# EasyEDA Pro project BN-CAN.epro

# Board PCB5
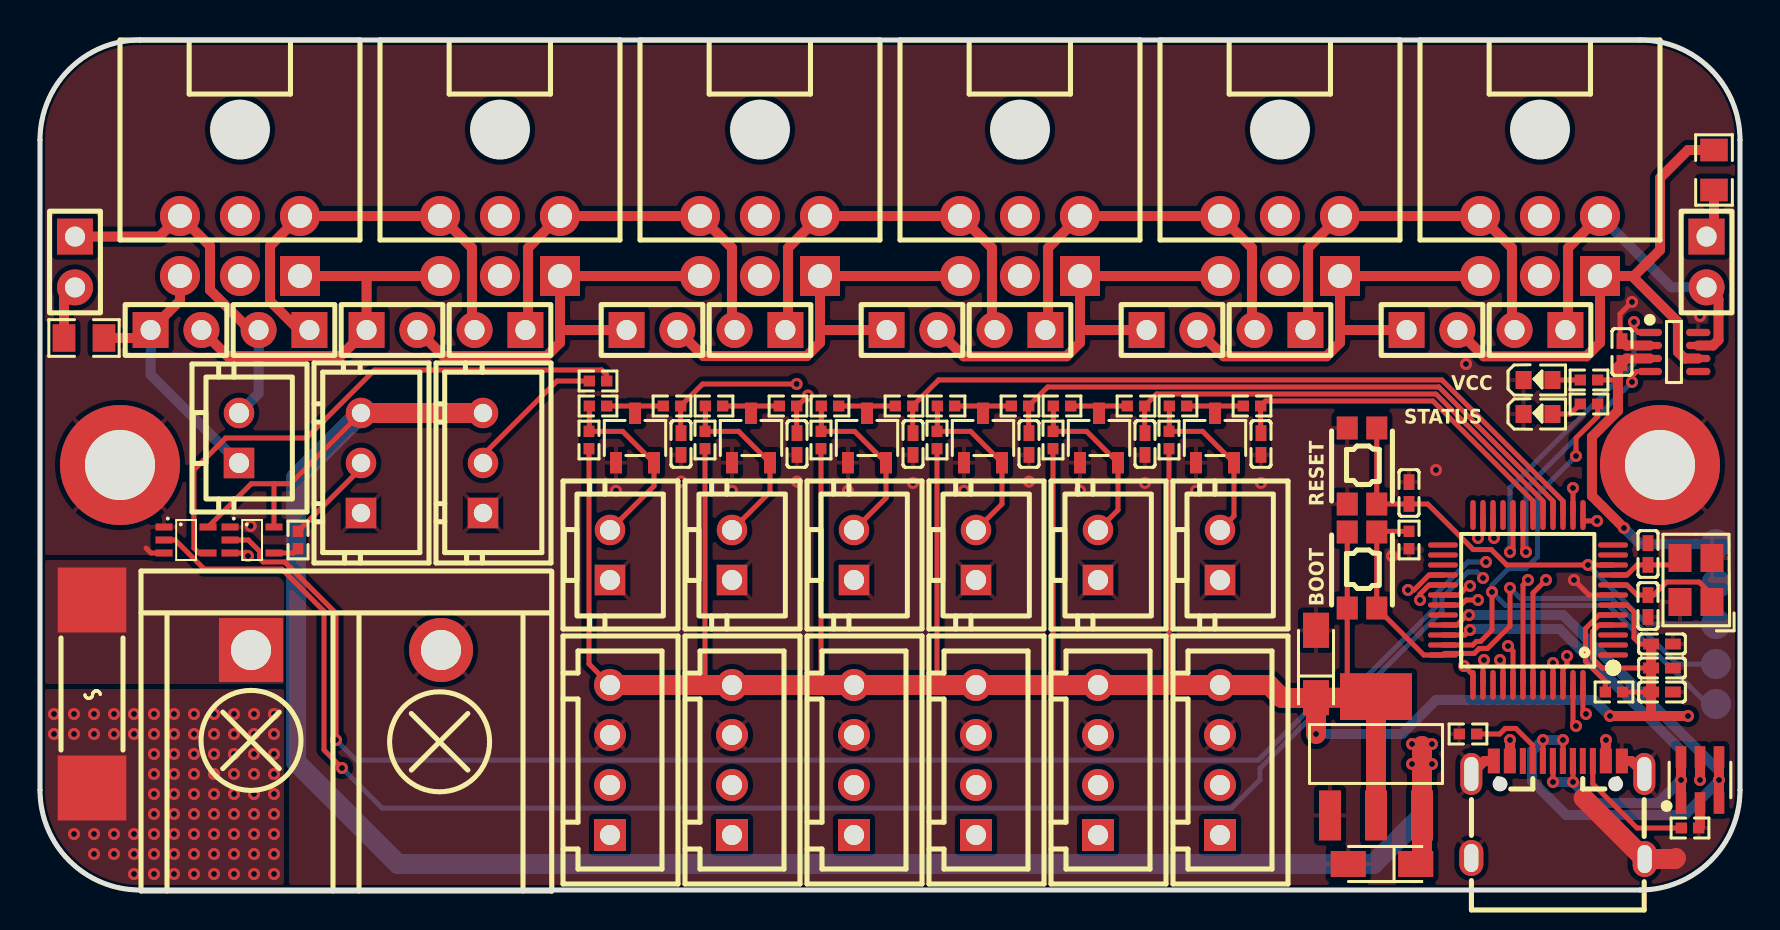
[diagram p0: board, top side]
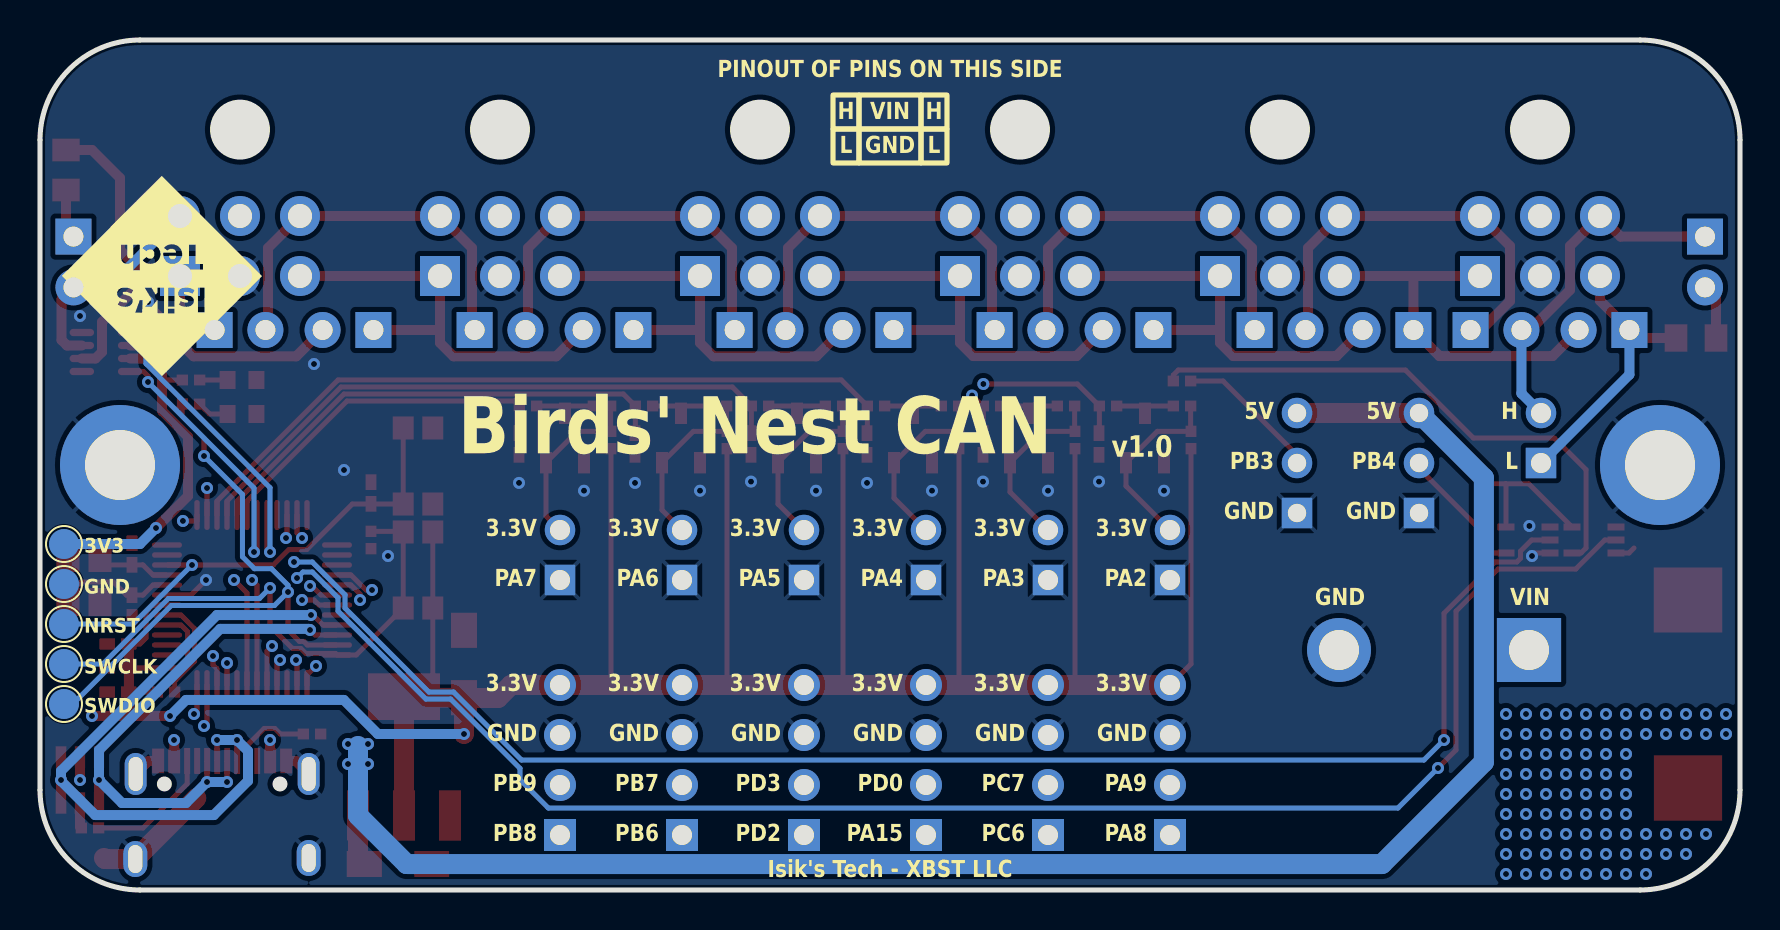
[diagram p1: board, bottom side, seen from below]

Outline 85 x 42.5 mm; copper layers: Top Layer, Inner1, Inner2, Bottom Layer. Coordinates in mm from the lower left corner of the outline.
Outline path: 0,37.5 0,5 arc(1.46,1.46) 5,0 80,0 arc(83.54,1.46) 85,5 85,37.5 arc(83.54,41.04) 80,42.5 5,42.5 arc(1.46,41.04) 0,37.5
Stack: Top Layer 0.035mm 外层铜厚1oz / Dielectric1 0.2104mm 7628 RC49% 8.6mil / Inner1 0.0152mm 内层铜厚 / Dielectric2 1.065mm 1.1mm H/HOZ 含铜 / Inner2 0.0152mm 内层铜厚 / Dielectric3 0.2104mm 7628 RC49% 8.6mil / Bottom Layer 0.035mm 外层铜厚1oz

## Design rules (mm)
template: Custom Config
spacing copperThickness1oz (default): track to track 0.102, other pairs 0.152 to 0.3
spacing copperThickness2oz: track to track 0.203, other pairs 0.152 to 0.3
track width copperThickness1oz (default): min 0.127, default 0.254, max 2.54
track width copperThickness2oz: min 0.203, default 0.254, max 2.54
differential pair differentialPair (default): width min 0.127, default 0.254, max 2.54; gap min 0.152, default 0.152
via viaSize (default): diameter min 0.5, default 0.61, max 10; hole min 0.3, default 0.305, max 6.3
pour e106 uses copperRegion1
pour e108 uses copperRegion1

## Placement (name value [footprint] x y rotation side)
3V3  NO  [TP]  83.8 17.3 180 bottom
BOOT  EVPAA202K  [KEY-SMD_4P-L3.5-W2.9-P1.48-LS4.3-TL]  66.1 16 90 top
C1  10uF  [CAP-SMD_L3.2-W1.6-RD-C7171]  67.1 1.3 180 top
C2  10uF  [CAP-SMD_L3.2-W1.6-RD-C7171]  63.8 11.3 90 top
C3  100nF  [C0402]  81.1 11.1 180 top
C4  100nF  [C0402]  32.05 22.3 90 top
C5  30pF  [C0402]  80.4 14.2 90 top
C6  30pF  [C0402]  80.4 16.8 270 top
C7  100nF  [C0402]  81.1 12.3 180 top
C8  100nF  [C0402]  81.1 9.9 180 top
C9  100nF  [C0402]  37.85 22.3 90 top
C10  100nF  [C0402]  68.45 19.85 90 top
C11  100nF  [C0402]  43.65 22.3 90 top
C12  100nF  [C0402]  79.1 26.9 270 top
C13  100nF  [C0402]  49.45 22.3 90 top
C14  100nF  [C0402]  55.25 22.3 90 top
C15  100nF  [C0402]  61.05 22.3 90 top
CAN1  HC-MX3.0-2*3AW  [CONN-TH_6P-P3.00_HC-MX3.0-2X3AW]  75 32.2 180 top
CAN2  HC-MX3.0-2*3AW  [CONN-TH_6P-P3.00_HC-MX3.0-2X3AW]  62 32.2 180 top
CAN3  HC-MX3.0-2*3AW  [CONN-TH_6P-P3.00_HC-MX3.0-2X3AW]  49 32.2 180 top
CAN4  HC-MX3.0-2*3AW  [CONN-TH_6P-P3.00_HC-MX3.0-2X3AW]  36 32.2 180 top
CAN5  HC-MX3.0-2*3AW  [CONN-TH_6P-P3.00_HC-MX3.0-2X3AW]  23 32.2 180 top
CAN6  HC-MX3.0-2*3AW  [CONN-TH_6P-P3.00_HC-MX3.0-2X3AW]  10 32.2 180 top
CAN_EXP  B2B-XH-A-BK(LF)(SN)  [CONN-TH_2P-P2.50_JST_B2B-XH-A-M]  9.95 22.6 270 top
CAN_TERM1  B-2100S02P-A110  [HDR-TH_2P-P2.54-V-M-1]  83.33 31.4 270 top
CAN_TERM2  B-2100S02P-A110  [HDR-TH_2P-P2.54-V-M-1]  1.75 31.4 270 top
D1  USBLC6-2SC6  [SOT-23-6_L2.9-W1.6-P0.95-LS2.8-BL]  83 5.5 0 top
D2  BAV99,215  [SOT-23-3_L2.9-W1.6-P1.90-LS2.8-BR]  29.75 22.6 270 top
D3  BAV99,215  [SOT-23-3_L2.9-W1.6-P1.90-LS2.8-BR]  35.55 22.6 270 top
D4  BAV99,215  [SOT-23-3_L2.9-W1.6-P1.90-LS2.8-BR]  41.35 22.6 270 top
D5  BAV99,215  [SOT-23-3_L2.9-W1.6-P1.90-LS2.8-BR]  47.15 22.6 270 top
D6  BAV99,215  [SOT-23-3_L2.9-W1.6-P1.90-LS2.8-BR]  52.95 22.6 270 top
D7  BAV99,215  [SOT-23-3_L2.9-W1.6-P1.90-LS2.8-BR]  58.75 22.6 270 top
F1  0456030.ER  [FUSE-SMD_L10.1-W3.1]  2.6 9.8 90 top
FS1  B4B-XH-A-BK(LF)(SN)  [CONN-TH_B4B-XH-A-BK-LF-SN]  59 6.5 90 top
FS2  B4B-XH-A-BK(LF)(SN)  [CONN-TH_B4B-XH-A-BK-LF-SN]  52.9 6.5 90 top
FS3  B4B-XH-A-BK(LF)(SN)  [CONN-TH_B4B-XH-A-BK-LF-SN]  46.8 6.5 90 top
FS4  B4B-XH-A-BK(LF)(SN)  [CONN-TH_B4B-XH-A-BK-LF-SN]  40.7 6.5 90 top
FS5  B4B-XH-A-BK(LF)(SN)  [CONN-TH_B4B-XH-A-BK-LF-SN]  34.6 6.5 90 top
FS6  B4B-XH-A-BK(LF)(SN)  [CONN-TH_B4B-XH-A-BK-LF-SN]  28.5 6.5 90 top
GND  NO  [TP]  83.8 15.3 180 bottom
H_JUMPER1  B-2100S02P-A110  [HDR-TH_2P-P2.54-V-M-1]  75 28 180 top
H_JUMPER2  B-2100S02P-A110  [HDR-TH_2P-P2.54-V-M-1]  62 28 180 top
H_JUMPER3  B-2100S02P-A110  [HDR-TH_2P-P2.54-V-M-1]  49 28 180 top
H_JUMPER4  B-2100S02P-A110  [HDR-TH_2P-P2.54-V-M-1]  36 28 180 top
H_JUMPER5  B-2100S02P-A110  [HDR-TH_2P-P2.54-V-M-1]  23 28 180 top
H_JUMPER6  B-2100S02P-A110  [HDR-TH_2P-P2.54-V-M-1]  12.2 28 180 top
L_JUMPER1  B-2100S02P-A110  [HDR-TH_2P-P2.54-V-M-1]  69.6 28 0 top
L_JUMPER2  B-2100S02P-A110  [HDR-TH_2P-P2.54-V-M-1]  56.6 28 0 top
L_JUMPER3  B-2100S02P-A110  [HDR-TH_2P-P2.54-V-M-1]  43.6 28 0 top
L_JUMPER4  B-2100S02P-A110  [HDR-TH_2P-P2.54-V-M-1]  30.6 28 0 top
L_JUMPER5  B-2100S02P-A110  [HDR-TH_2P-P2.54-V-M-1]  17.6 28 0 top
L_JUMPER6  B-2100S02P-A110  [HDR-TH_2P-P2.54-V-M-1]  6.8 28 0 top
NOREF  -  [Pad_e236]  81 21.25 0 top
NOREF#2  -  [Pad_e234]  4 21.25 0 top
NRST  NO  [TP]  83.8 13.3 180 bottom
R1  5.1kΩ  [R0402]  82.5 3.1 180 top
R2  470Ω  [R0402]  27.9 25.45 180 top
R3  470Ω  [R0402]  12.9 17.5 90 top
R4  5.1kΩ  [R0402]  71.4 7.8 180 top
R6  4.7kΩ  [R0402]  27.45 22.5 90 top
R7  2.37kΩ  [R0402]  27.9 24.2 0 top
R8  2.37kΩ  [R0402]  31.6 24.2 0 top
R9  1.5kΩ  [R0402]  77.45 25.5 180 top
R10  10Ω  [R0402]  78.7 9.9 0 top
R11  1.5kΩ  [R0402]  77.45 24.3 180 top
R12  4.7kΩ  [R0402]  33.25 22.5 90 top
R13  10kΩ  [R0402]  68.45 17.5 270 top
R14  2.37kΩ  [R0402]  33.7 24.2 0 top
R15  2.37kΩ  [R0402]  37.4 24.2 0 top
R16  4.7kΩ  [R0402]  39.05 22.5 90 top
R17  2.37kΩ  [R0402]  39.5 24.2 0 top
R18  2.37kΩ  [R0402]  43.2 24.2 0 top
R19  120Ω  [R0805]  83.7 36 90 top
R20  4.7kΩ  [R0402]  44.85 22.5 90 top
R21  2.37kΩ  [R0402]  45.3 24.2 0 top
R22  2.37kΩ  [R0402]  49 24.2 0 top
R23  4.7kΩ  [R0402]  50.65 22.5 90 top
R24  2.37kΩ  [R0402]  51.1 24.2 0 top
R25  2.37kΩ  [R0402]  54.8 24.2 0 top
R26  4.7kΩ  [R0402]  56.45 22.5 90 top
R27  2.37kΩ  [R0402]  56.9 24.2 0 top
R28  2.37kΩ  [R0402]  60.6 24.2 0 top
R29  120Ω  [R0805]  2.2 27.6 180 top
RESET  EVPAA202K  [KEY-SMD_4P-L3.5-W2.9-P1.48-LS4.3-TL]  66.1 21.2 90 top
RGB1  B3B-XH-A-BK(LF)(SN)  [conn-th_3p-p2.50_b3b-xh-a-bk-lf-sn]  22.15 21.35 270 top
RGB2  B3B-XH-A-BK(LF)(SN)  [conn-th_3p-p2.50_b3b-xh-a-bk-lf-sn]  16.05 21.35 270 top
STATUS  19-217/BHC-ZL1M2RY/3T  [LED0603-FD_BLUE]  74.9 23.8 0 top
SWCLK  NO  [TP]  83.8 11.3 180 bottom
SWDIO  NO  [TP]  83.8 9.3 180 bottom
TERM  HB9500M-9.5-2P  [CONN-TH_HB9500M-9.5-2P]  15.3 12 0 top
TH1  B2B-XH-A-BK(LF)(SN)  [CONN-TH_2P-P2.50_JST_B2B-XH-A-M]  28.5 16.75 270 top
TH2  B2B-XH-A-BK(LF)(SN)  [CONN-TH_2P-P2.50_JST_B2B-XH-A-M]  34.6 16.75 270 top
TH3  B2B-XH-A-BK(LF)(SN)  [CONN-TH_2P-P2.50_JST_B2B-XH-A-M]  40.7 16.75 270 top
TH4  B2B-XH-A-BK(LF)(SN)  [CONN-TH_2P-P2.50_JST_B2B-XH-A-M]  46.8 16.75 270 top
TH5  B2B-XH-A-BK(LF)(SN)  [CONN-TH_2P-P2.50_JST_B2B-XH-A-M]  52.9 16.75 270 top
TH6  B2B-XH-A-BK(LF)(SN)  [CONN-TH_2P-P2.50_JST_B2B-XH-A-M]  59 16.75 270 top
U1  SN74AHCT1G125DCKR  [SC-70-5_L2.0-W1.3-P0.65-LS2.1-BL]  7.3 17.5 270 top
U2  SN74AHCT1G125DCKR  [SC-70-5_L2.0-W1.3-P0.65-LS2.1-BL]  10.6 17.5 270 top
U4  AMS1117-3.3  [SOT-223-3_L6.5-W3.4-P2.30-LS7.0-BR]  66.8 6.7 270 top
U5  MAX3051EKA+T  [SOT-23-8_L3.0-W1.7-P0.65-LS2.8-TL]  81.7 26.9 0 top
U6  STM32G0B1CBT6  [LQFP-48_L7.0-W7.0-P0.50-LS9.0-BL]  74.4 14.5 90 top
USBC  918-418K2023S40001  [usb-c-smd_type-c-usb-17]  75.9 4 0 top
VCC  19-217/BHC-ZL1M2RY/3T  [LED0603-FD_BLUE]  74.9 25.5 0 top
X1  8MHz  [CRYSTAL-SMD_4P-L3.2-W2.5-BL-2]  82.8 15.5 90 top

## Footprints (pads in the part's own frame, mm; a bottom-side part is the same pattern mirrored in y, then rotated)
C0402
  rect 0.79x0.54 smd: 1(-0.545,0) 2(0.545,0)
CAP-SMD_L3.2-W1.6-RD-C7171
  rect 1.758x1.296 smd: 1(-1.687,0) 2(1.687,0)
CONN-TH_2P-P2.50_JST_B2B-XH-A-M
  rect 1.524x1.524 hole 1: 1(1.25,0)
  round 1.524 hole 1: 2(-1.25,0)
conn-th_3p-p2.50_b3b-xh-a-bk-lf-sn
  round 1.524 hole 0.914: 1(-2.5,0) 2(0,0)
  rect 1.524x1.524 hole 0.914: 3(2.5,0)
CONN-TH_6P-P3.00_HC-MX3.0-2X3AW
  rect 2x2 hole 1.2: 1(-3,1.5)
  round 2 hole 1.2: 2(-3,-1.5) 3(0,1.5) 4(0,-1.5) 5(3,1.5) 6(3,-1.5)
CONN-TH_B4B-XH-A-BK-LF-SN
  rect 1.6x1.6 hole 1: 1(-3.75,0)
  round 1.6 hole 1: 2(-1.25,0) 3(1.25,0) 4(3.75,0)
CONN-TH_HB9500M-9.5-2P
  rect 3.21x3.2 hole 2: 1(-4.75,0)
  round 3.2 hole 2: 2(4.75,0)
CRYSTAL-SMD_4P-L3.2-W2.5-BL-2
  rect 1.4x1.15 smd: 1(-1.1,-0.8) 2(1.1,-0.8) 3(1.1,0.8) 4(-1.1,0.8)
FUSE-SMD_L10.1-W3.1
  rect 3.25x3.43 smd: 1(-4.7,0) 2(4.7,0)
HDR-TH_2P-P2.54-V-M-1
  rect 1.8x1.8 hole 1: 1(-1.27,0)
  round 1.8 hole 1: 2(1.27,0)
KEY-SMD_4P-L3.5-W2.9-P1.48-LS4.3-TL
  rect 1.15x1.05 smd: 1(-1.902,0.74) 1'(1.899,0.74) 2(-1.902,-0.74) 2'(1.902,-0.74)
LED0603-FD_BLUE
  rect 0.8x0.9 smd: 1(-0.72,0) 2(0.72,0)
LQFP-48_L7.0-W7.0-P0.50-LS9.0-BL
  oval 0.27x1.5 smd: 1(-2.75,-4.25) 2(-2.25,-4.25) 3(-1.75,-4.25) 4(-1.25,-4.25) 5(-0.75,-4.25) 6(-0.25,-4.25) 7(0.25,-4.25) 8(0.75,-4.25) 9(1.25,-4.25) 10(1.75,-4.25) 11(2.25,-4.25) 12(2.75,-4.25) 25(2.75,4.25) 26(2.25,4.25) 27(1.75,4.25) 28(1.25,4.25) 29(0.75,4.25) 30(0.25,4.25) 31(-0.25,4.25) 32(-0.75,4.25) 33(-1.25,4.25) 34(-1.75,4.25) 35(-2.25,4.25) 36(-2.75,4.25)
  oval 1.5x0.27 smd: 13(4.25,-2.75) 14(4.25,-2.25) 15(4.25,-1.75) 16(4.25,-1.25) 17(4.25,-0.75) 18(4.25,-0.25) 19(4.25,0.25) 20(4.25,0.75) 21(4.25,1.25) 22(4.25,1.75) 23(4.25,2.25) 24(4.25,2.75) 37(-4.25,2.75) 38(-4.25,2.25) 39(-4.25,1.75) 40(-4.25,1.25) 41(-4.25,0.75) 42(-4.25,0.25) 43(-4.25,-0.25) 44(-4.25,-0.75) 45(-4.25,-1.25) 46(-4.25,-1.75) 47(-4.25,-2.25) 48(-4.25,-2.75)
Pad_e234
  round 6 hole 3.5: 49(0,0)
Pad_e236
  round 6 hole 3.5: 49(0,0)
R0402
  rect 0.566x0.54 smd: 1(-0.433,0) 2(0.433,0)
R0805
  rect 1.133x1.377 smd: 1(-1,0) 2(1,0)
SC-70-5_L2.0-W1.3-P0.65-LS2.1-BL
  rect 0.35x0.85 smd: 1(-0.65,-1.1) 2(0,-1.1) 3(0.65,-1.1) 4(0.65,1.1) 5(-0.65,1.1)
SOT-23-3_L2.9-W1.6-P1.90-LS2.8-BR
  rect 1.07x0.6 smd: 1(1.235,-0.95) 2(1.235,0.95) 3(-1.235,0)
SOT-23-6_L2.9-W1.6-P0.95-LS2.8-BL
  rect 0.532x1.072 smd: 1(-0.95,-1.149) 2(0,-1.149) 3(0.95,-1.149) 4(0.95,1.149) 5(0,1.149) 6(-0.95,1.149)
SOT-23-8_L3.0-W1.7-P0.65-LS2.8-TL
  oval 1.222x0.364 smd: 1(-1.211,0.975) 2(-1.211,0.325) 3(-1.211,-0.325) 4(-1.211,-0.975) 5(1.211,-0.975) 6(1.211,-0.325) 7(1.211,0.325) 8(1.211,0.975)
SOT-223-3_L6.5-W3.4-P2.30-LS7.0-BR
  rect 2.5x1.1 smd: 1(2.97,-2.3) 2(2.97,0) 3(2.97,2.3)
  rect 2.34x3.6 smd: 4(-2.97,0)
TP
  round 1.5 smd: 1(0,0)
usb-c-smd_type-c-usb-17
  oval 1.1x2.1 hole 0.7x1.7: 0(-4.334,1.802) 0(4.316,1.802)
  oval 1.2x1.8 hole 0.7x1.4: 0(-4.334,-2.398) 0(4.334,-2.453)
  rect 0.6x1.24 smd: A1(-3.209,2.451) A4(-2.409,2.451) A9(2.391,2.452) A12(3.191,2.451)
  rect 0.3x1.3 smd: A5(-1.259,2.451) A6(-0.259,2.451) A7(0.241,2.451) A8(1.24,2.453) B5(1.741,2.451) B6(0.741,2.451) B7(-0.759,2.451) B8(-1.759,2.453)

## Nets
3V3: 3V3.1 BOOT.1 BOOT.1' C2.1 C3.2 C7.2 C8.2 C12.2 FS1.4 FS2.4 FS3.4 FS4.4 FS5.4 FS6.4 R6.1 R9.1 R10.2 R12.1 R16.1 R20.1 R23.1 R26.1 U4.2 U4.4 U5.3 U6.4 U6.6
+5V: C1.1 D1.5 RGB1.1 RGB2.1 U1.5 U2.5 U4.3 USBC.A4 USBC.A9
GND: C1.2 C2.2 C3.1 C4.1 C5.1 C6.1 C7.1 C8.1 C9.1 C10.2 C11.1 C12.1 C13.1 C14.1 C15.1 CAN1.3 CAN2.3 CAN3.3 CAN4.3 CAN5.3 CAN6.3 D1.2 D2.1 D3.1 D4.1 D5.1 D6.1 D7.1 FS1.3 FS2.3 FS3.3 FS4.3 FS5.3 FS6.3 GND.1 NOREF.49 NOREF#2.49 R1.1 R4.2 R13.2 RESET.1 RESET.1' RGB1.3 RGB2.3 STATUS.1 TERM.2 TH1.1 TH2.1 TH3.1 TH4.1 TH5.1 TH6.1 U1.1 U1.3 U2.1 U2.3 U4.1 U5.2 U5.8 U6.7 USBC.0 USBC.A1 USBC.A12 VCC.1 X1.2 X1.4
VIN: CAN1.4 CAN2.4 CAN3.4 CAN4.4 CAN5.4 CAN6.4 F1.1
$CAN1_5: CAN1.5 CAN2.1 L_JUMPER1.1 L_JUMPER2.2
$CAN1_6: CAN1.6 CAN2.2 H_JUMPER1.2 H_JUMPER2.1
$CAN2_5: CAN2.5 CAN3.1 L_JUMPER2.1 L_JUMPER3.2
$CAN2_6: CAN2.6 CAN3.2 H_JUMPER2.2 H_JUMPER3.1
$CAN3_5: CAN3.5 CAN4.1 L_JUMPER3.1 L_JUMPER4.2
$CAN3_6: CAN3.6 CAN4.2 H_JUMPER3.2 H_JUMPER4.1
$CAN4_5: CAN4.5 CAN5.1 L_JUMPER4.1 L_JUMPER5.2
$CAN4_6: CAN4.6 CAN5.2 H_JUMPER4.2 H_JUMPER5.1
$CAN5_5: CAN5.5 CAN6.1 L_JUMPER5.1 L_JUMPER6.2
$CAN5_6: CAN5.6 CAN6.2 H_JUMPER5.2 H_JUMPER6.1
$D2_2: D2.2 R6.2 R7.1 TH1.2
$D2_3: D2.3 R7.2 R8.1
$D3_2: D3.2 R12.2 R14.1 TH2.2
$D3_3: D3.3 R14.2 R15.1
$D4_2: D4.2 R16.2 R17.1 TH3.2
$D4_3: D4.3 R17.2 R18.1
$D5_2: D5.2 R20.2 R21.1 TH4.2
$D5_3: D5.3 R21.2 R22.1
$D6_2: D6.2 R23.2 R24.1 TH5.2
$D6_3: D6.3 R24.2 R25.1
$D7_2: D7.2 R26.2 R27.1 TH6.2
$D7_3: D7.3 R27.2 R28.1
$F1_2: F1.2 TERM.1
$R1_2: R1.2 USBC.B5
$R2_1: R2.1 U1.4
$R2_2: R2.2 RGB1.2
$R3_1: R3.1 U2.4
$R3_2: R3.2 RGB2.2
$R4_1: R4.1 USBC.A5
$R9_2: R9.2 VCC.2
$R10_1: R10.1 U6.5
$R11_2: R11.2 STATUS.2
$R19_1: CAN_TERM1.1 R19.1
$R29_2: CAN_TERM2.2 R29.2
DN: D1.3 D1.4 U6.33 USBC.A7 USBC.B7
DP: D1.1 D1.6 U6.34 USBC.A6 USBC.B6
FE1: FS1.1 U6.47
FE2: FS2.1 U6.45
FE3: FS3.1 U6.40
FE4: FS4.1 U6.37
FE5: FS5.1 U6.30
FE6: FS6.1 U6.28
FS1: FS1.2 U6.48
FS2: FS2.2 U6.46
FS3: FS3.2 U6.41
FS4: FS4.2 U6.38
FS5: FS5.2 U6.31
FS6: FS6.2 U6.29
H: CAN1.2 CAN_TERM1.2 H_JUMPER1.1 U5.7
HO: CAN6.6 CAN_EXP.2 CAN_TERM2.1 H_JUMPER6.2
L: CAN1.1 L_JUMPER1.2 R19.2 U5.6
LO: CAN6.5 CAN_EXP.1 L_JUMPER6.1 R29.1
N1: U1.2 U6.42
N2: U2.2 U6.43
NRST: C10.1 NRST.1 RESET.2 RESET.2' U6.10
RX: U5.4 U6.19
SWCLK: BOOT.2 BOOT.2' R13.1 SWCLK.1 U6.36
SWDIO: R11.1 SWDIO.1 U6.35
TH1: C4.2 R8.2 U6.13
TH2: C9.2 R15.2 U6.14
TH3: C11.2 R18.2 U6.15
TH4: C13.2 R22.2 U6.16
TH5: C14.2 R25.2 U6.17
TH6: C15.2 R28.2 U6.18
TX: U5.1 U6.20
XIN: C5.2 U6.8 X1.1
XOUT: C6.2 U6.9 X1.3

Pads without a net: U5 5; U6 1 2 3 11 12 21 22 23 24 25 26 27 32 39 44; USBC A8 B8

## Via types
v1: diameter 0.6, hole 0.3, Top Layer to Bottom Layer, 152 vias

## Routing (per net, layer and track width the routed paths; a pad name or vN(x,y) marks a point on that pad's centre or on a via; arc(x,y) is an arc through that point)
3V3: length 198.6
  Top Layer w0.25: FS4.4 39.05,10.25 R16.1 ; R23.1 50.65,10.25 FS2.4 ; R9.1 78.88,25.5 78.9,25.52 ; FS5.4 33.25,10.25 R12.1 ; C3.2 78.1,11.1 77.62,11.58 77.62,12.92 77.95,13.25 U6.4 ; R6.1 27.45,11.3 FS6.4 ; FS1.4 56.45,10.25 R26.1 ; U4.4 65.36,9.67 BOOT.1 BOOT.1' ; R20.1 44.85,10.25 FS3.4 ; U6.6 79.35,14.25 79.7,13.9 79.7,12.6 80,12.3 C7.2 ; R10.2 C8.2
  Top Layer w0.5: 80.56,8.7 v1(82.4,8.7) ; 80.56,8.7 v1(78.5,8.7) ; 80.56,8.7 C8.2 C3.2 C7.2 ; v1(79.2,18.1) 77.6,19.7 77.6,22.66 78.9,23.96 78.9,26.15 C12.2 79.32,26.58 U5.3
  Top Layer w1: C2.1 v1(63.8,7.8) ; C2.1 66.74,9.61 U4.4 U4.2 ; C2.1 63.79,9.6 62.1,9.6 61.45,10.25 FS1.4 FS2.4 FS3.4 FS4.4 FS5.4 FS6.4
  Inner2 w0.5: v1(79.2,18.1) 82.4,14.9 v1(82.4,8.7)
  Bottom Layer w0.5: v1(79.2,18.1) 80,17.3 3V3.1 ; v1(63.8,7.8) 68.11,7.8 69.81,9.5 77.7,9.5 v1(78.5,8.7)
+5V: length 109.2
  Top Layer w0.25: 11.71,20.31 10.56,20.31 U1.5 ; 11.71,20.31 12.51,20.31 RGB2.1 ; 11.71,20.31 11.7,20.3 U2.5
  Top Layer w0.5: v1(73.5,7.5) 73.5,6.46 USBC.A4 ; USBC.A9 78.29,7.49 v1(78.3,7.5) ; D1.5 v1(83,5.5)
  Top Layer w1: 69.1,7.2 U4.3 69.1,1.61 C1.1 ; RGB2.1 RGB1.1
  Bottom Layer w1: 69.1,7.2 U4.3 66.67,1.3 17.9,1.3 12.81,6.39 12.81,20.61 RGB2.1
  vias: v1(68.6,7.3) v1(68.6,6.3) v1(69.6,7.3) v1(69.6,6.3)
GND: length 17.9
  Top Layer w0.25: v1(10.4,16.7) 10.25,16.85 U2.3 ; v1(76.7,15.5) 77.45,14.75 U6.7 ; U1.3 5.55,16.85 5.3,17.1 ; 79.1,27.44 79,27.55 79,28.8 v1(79.6,29.4)
  Top Layer w0.5: D1.2 83,3.17 R1.1 ; 79.1,27.44 79.32,27.22 80.49,27.22 ; USBC.0 79.57,6.45 USBC.A12 ; USBC.A1 72.22,6.45 USBC.0
  Top Layer w1: 77.18,4.6 USBC.0 81.75,1.55 81.8,1.6
  vias: v1(10.53,18.2) v1(28.8,19.97) v1(32.05,20.42) v1(34.6,19.97) v1(37.85,20.42) v1(40.4,19.97) v1(43.65,20.36) v1(46.2,19.97) v1(49.45,20.42) v1(52,19.97) v1(55.25,20.36) v1(57.8,19.97) v1(61.05,20.36) v1(67.6,16.7) v1(69.8,21) v1(71.3,26.3) v1(83,28.7)
VIN:
  vias: v1(0.7,8.8) v1(0.7,7.8) v1(1.7,8.8) v1(1.7,7.8) v1(1.7,2.8) v1(2.7,8.8) v1(2.7,7.8) v1(2.7,2.8) v1(2.7,1.8) v1(3.7,8.8) v1(3.7,7.8) v1(3.7,2.8) v1(3.7,1.8) v1(4.7,8.8) v1(4.7,7.8) v1(4.7,2.8) v1(4.7,1.8) v1(4.7,0.8) v1(5.7,8.8) v1(5.7,7.8) v1(5.7,6.8) v1(5.7,5.8) v1(5.7,4.8) v1(5.7,3.8) v1(5.7,2.8) v1(5.7,1.8) v1(5.7,0.8) v1(6.7,8.8) v1(6.7,7.8) v1(6.7,6.8) v1(6.7,5.8) v1(6.7,4.8) v1(6.7,3.8) v1(6.7,2.8) v1(6.7,1.8) v1(6.7,0.8) v1(7.7,8.8) v1(7.7,7.8) v1(7.7,6.8) v1(7.7,5.8) v1(7.7,4.8) v1(7.7,3.8) v1(7.7,2.8) v1(7.7,1.8) v1(7.7,0.8) v1(8.7,8.8) v1(8.7,7.8) v1(8.7,6.8) v1(8.7,5.8) v1(8.7,4.8) v1(8.7,3.8) v1(8.7,2.8) v1(8.7,1.8) v1(8.7,0.8) v1(9.7,8.8) v1(9.7,7.8) v1(9.7,6.8) v1(9.7,5.8) v1(9.7,4.8) v1(9.7,3.8) v1(9.7,2.8) v1(9.7,1.8) v1(9.7,0.8) v1(10.7,8.8) v1(10.7,7.8) v1(10.7,6.8) v1(10.7,5.8) v1(10.7,4.8) v1(10.7,3.8) v1(10.7,2.8) v1(10.7,1.8) v1(10.7,0.8) v1(11.7,8.8) v1(11.7,7.8) v1(11.7,6.8) v1(11.7,5.8) v1(11.7,4.8) v1(11.7,3.8) v1(11.7,2.8) v1(11.7,1.8) v1(11.7,0.8)
(no net): length 2.4
  Top Layer w0.25: U6.23 72.15,17.85 v1(71.9,17.6) ; v1(72.7,17.6) 72.65,17.65 U6.22
$CAN1_5: length 21.6
  Top Layer w0.5: 65,28 CAN2.1 CAN1.5 ; 65,28 L_JUMPER1.1 ; 65,28 65,27.36 64.32,26.68 59.19,26.68 L_JUMPER2.2
$CAN1_6: length 19.8
  Top Layer w0.5: H_JUMPER1.2 73.6,28.13 73.6,32.1 CAN1.6 CAN2.2 63.4,32.1 63.4,28.13 H_JUMPER2.1
$CAN2_5: length 21.6
  Top Layer w0.5: 52,28 L_JUMPER2.1 ; 52,28 CAN3.1 CAN2.5 ; 52,28 52,27.36 51.32,26.68 46.19,26.68 L_JUMPER3.2
$CAN2_6: length 19.8
  Top Layer w0.5: H_JUMPER2.2 60.6,28.13 60.6,32.1 CAN2.6 CAN3.2 50.4,32.1 50.4,28.13 H_JUMPER3.1
$CAN3_5: length 21.6
  Top Layer w0.5: CAN3.5 CAN4.1 39,28 ; 39,28 39,27.36 38.34,26.7 33.17,26.7 L_JUMPER4.2 ; 39,28 L_JUMPER3.1
$CAN3_6: length 19.8
  Top Layer w0.5: H_JUMPER3.2 47.6,28.13 47.6,32.1 CAN3.6 CAN4.2 37.4,32.1 37.4,28.13 H_JUMPER4.1
$CAN4_5: length 21.6
  Top Layer w0.5: 26,28 L_JUMPER4.1 ; 26,28 CAN5.1 CAN4.5 ; 26,28 26,27.36 25.34,26.7 20.17,26.7 L_JUMPER5.2
$CAN4_6: length 19.8
  Top Layer w0.5: H_JUMPER5.1 24.4,28.13 24.4,32.1 CAN5.2 CAN4.6 34.6,32.1 34.6,28.13 H_JUMPER4.2
$CAN5_5: length 19
  Top Layer w0.5: 16.34,30.7 CAN6.1 ; 16.34,30.7 16.33,30.69 L_JUMPER5.1 15.03,26.7 9.37,26.7 L_JUMPER6.2 ; 16.34,30.7 CAN5.5
$CAN5_6: length 20.9
  Top Layer w0.5: H_JUMPER5.2 21.6,28.13 21.6,32.1 CAN5.6 CAN6.2 11.5,32.2 11.5,29.45 12.95,28 H_JUMPER6.1
$D2_2: length 9.4
  Top Layer w0.25: R7.1 27.47,22.95 R6.2 29.13,22.93 D2.2 30.7,20.2 TH1.2
$D2_3: length 2.8
  Top Layer w0.25: R7.2 R8.1
$D3_2: length 9.3
  Top Layer w0.25: TH2.2 36.5,19.9 D3.2 34.93,22.93 R12.2 33.27,22.95 R14.1
$D3_3: length 2.8
  Top Layer w0.25: R14.2 R15.1
$D4_2: length 9.2
  Top Layer w0.25: R17.1 39.07,22.95 R16.2 40.73,22.93 D4.2 42.3,19.6 TH3.2
$D4_3: length 2.8
  Top Layer w0.25: R17.2 R18.1
$D5_2: length 9.1
  Top Layer w0.25: R21.1 44.87,22.95 R20.2 46.53,22.93 D5.2 48.1,19.3 TH4.2
$D5_3: length 2.8
  Top Layer w0.25: R21.2 R22.1
$D6_2: length 9
  Top Layer w0.25: TH5.2 53.9,19 D6.2 52.33,22.93 R23.2 50.67,22.95 R24.1
$D6_3: length 2.8
  Top Layer w0.25: R24.2 R25.1
$D7_2: length 8.8
  Top Layer w0.25: TH6.2 59.7,18.7 D7.2 58.13,22.93 R26.2 56.47,22.95 R27.1
$D7_3: length 2.8
  Top Layer w0.25: R27.2 R28.1
$R1_2: length 6.5
  Top Layer w0.25: R1.2 79.85,3.1 77.64,5.31 77.64,6.45
$R2_1: length 27.8
  Top Layer w0.25: R2.1 28.33,25.75 28.08,26 16.73,26 13.33,22.6 9.28,22.6 7.7,21.01 7.7,17.1 7.95,16.85 U1.4
$R2_2: length 7.3
  Top Layer w0.25: RGB1.2 22.15,21.75 25.85,25.45 R2.2
$R3_1: length 1.3
  Top Layer w0.25: U2.4 12.68,16.85 R3.1
$R3_2: length 4.7
  Top Layer w0.25: RGB2.2 16.05,21.08 R3.2
$R4_1: length 4.1
  Top Layer w0.25: R4.1 72.98,7.8 73.26,8.08 73.79,8.08 74.64,7.23 74.64,6.45
$R9_2: length 1.4
  Top Layer w0.25: R9.2 VCC.2
$R10_1: length 5.2
  Top Layer w0.25: R10.1 78.27,10.44 77.27,11.43 77.27,13.07 77.95,13.75 U6.5
$R11_2: length 1.6
  Top Layer w0.25: R11.2 76.52,23.8 STATUS.2
$R19_1: length 2.5
  Top Layer w0.5: CAN_TERM1.1 83.7,33.04 R19.1
$R29_2: length 2.8
  Top Layer w0.5: R29.2 1.2,29.58 CAN_TERM2.2
DN: length 36.2
  Top Layer w0.25: v1(76.15,7.5) 76.15,6.46 76.14,6.45 ; v1(75.15,7.5) 75.15,6.46 75.14,6.45 ; U6.33 70.85,13.25 71.35,13.75 v1(71.45,13.75)
  Top Layer w0.5: D1.4 D1.3
  Bottom Layer w0.5: 71.45,13.75 71.45,13.75 76.15,13.75 83.95,5.95 v1(83.95,5.5) 83.95,5.46 82.24,3.75 76.31,3.75 74.6,5.46 74.6,6.95 v1(75.15,7.5) v1(76.15,7.5)
DP: length 27.8
  Top Layer w0.25: v1(76.65,5.4) 76.65,6.44 76.64,6.45 ; U6.34 71.25,12.75 v1(71.5,13) ; v1(75.65,5.4) 75.65,6.44 75.64,6.45
  Top Layer w0.5: D1.6 D1.1
  Bottom Layer w0.5: v1(75.65,5.4) v1(76.65,5.4) 77.7,4.35 80.9,4.35 v1(82.05,5.5) 82.05,6.99 75.99,13.06 71.56,13.06 v1(71.5,13)
FE1: length 22.2
  Top Layer w0.25: U6.47 76.65,8.35 v1(76.8,8.2)
  Inner2 w0.25: FS1.1 62.05,2.75 67.5,8.2 v1(76.8,8.2)
FE2: length 28.3
  Top Layer w0.25: v1(75.65,11.35) U6.45
  Inner2 w0.25: FS2.1 54.98,2.75 58.55,6.33 64.63,6.33 67.5,9.2 75,9.2 75.65,9.85 v1(75.65,11.35)
FE3: length 33.1
  Top Layer w0.25: v1(73,11.5) 73.15,11.35 U6.40
  Inner2 w0.25: FS3.1 46.8,3.17 52.63,9 55.73,9 58.41,11.68 59.59,11.68 61.01,10.26 72.6,10.26 73,10.66 v1(73,11.5)
FE4: length 36.6
  Top Layer w0.25: U6.37 71.65,10.75 v1(71.2,11.2)
  Inner2 w0.25: FS4.1 40.7,3.17 46.53,9 49.63,9 53.01,12.38 59.88,12.38 61.31,10.96 70.96,10.96 v1(71.2,11.2)
FE5: length 45
  Top Layer w0.25: U6.30 70.95,14.75 71.4,15.2 v1(71.5,15.2)
  Inner2 w0.25: FS5.1 34.6,3.17 40.43,9 43.53,9 46.38,11.85 51.49,11.85 52.72,13.09 60.18,13.09 61.58,11.68 67.88,11.68 71.4,15.2 v1(71.5,15.2)
FE6: length 49.5
  Top Layer w0.25: v1(68.4,15) 68.7,15 69.45,15.75 U6.28
  Inner2 w0.25: v1(68.4,15) 68.4,13.2 67.59,12.39 61.87,12.39 60.47,13.79 52.43,13.79 51.19,12.56 46.09,12.56 45.21,11.68 40.11,11.68 37.43,9 34.33,9 28.5,3.17 FS6.1
FS1: length 21.3
  Top Layer w0.25: U6.48 77.15,8.95 v1(77.3,8.8)
  Inner2 w0.25: FS1.2 64.05,5.25 67.6,8.8 v1(77.3,8.8)
FS2: length 27.8
  Top Layer w0.25: U6.46 76.15,11.06 76.35,11.26 v1(76.35,11.7)
  Inner2 w0.25: FS2.2 54.98,5.25 58.55,8.83 66.63,8.83 67.35,9.55 73.04,9.55 75.41,11.93 76.12,11.93 v1(76.35,11.7)
FS3: length 40.3
  Top Layer w0.25: v1(73.4,12.2) 73.65,11.95 U6.41
  Inner2 w0.25: v1(73.4,12.2) 73.58,12.02 73.58,10.68 72.8,9.9 60.87,9.9 59.45,11.33 58.55,11.33 53.73,6.5 52.63,6.5 47.8,1.67 45.89,1.67 45.72,1.84 45.72,3.66 46.8,4.74 FS3.2
FS4: length 43.1
  Top Layer w0.25: v1(72.2,11.5) 72.15,11.45 U6.38
  Inner2 w0.25: v1(72.2,11.5) 72.2,11.3 71.51,10.61 61.16,10.61 59.74,12.03 53.16,12.03 47.62,6.5 46.44,6.5 41.62,1.67 39.79,1.67 39.62,1.84 39.62,4.17 FS4.2
FS5: length 50.6
  Top Layer w0.25: v1(71.9,14.5) 71.3,14.5 71.05,14.25 U6.31
  Inner2 w0.25: FS5.2 34.6,4.74 33.52,3.66 33.52,1.84 33.69,1.67 35.6,1.67 40.43,6.5 41.53,6.5 46.53,11.5 51.63,11.5 52.87,12.73 60.03,12.73 61.43,11.33 68.03,11.33 71.2,14.5 v1(71.9,14.5)
FS6: length 54.6
  Top Layer w0.25: U6.29 69.45,15.25 69,14.8 v1(69,14.5)
  Inner2 w0.25: FS6.2 27.2,3.95 27.2,2 27.6,1.6 29.43,1.6 34.33,6.5 35.43,6.5 40.25,11.33 45.36,11.33 46.24,12.2 51.34,12.2 52.57,13.44 60.32,13.44 61.72,12.04 67.74,12.04 69,13.3 v1(69,14.5)
H: length 17.2
  Top Layer w0.5: 82.91,27.22 83.65,27.22 83.92,27.5 83.92,29.53 CAN_TERM1.2 ; CAN1.2 76.4,32.1 76.4,28.13 H_JUMPER1.1
  Bottom Layer w0.5: CAN1.2 81.57,30.13 CAN_TERM1.2
HO: length 17.8
  Top Layer w0.5: CAN_TERM2.1 5.97,32.67 CAN6.6 8.5,32.2 8.5,30 10.5,28 H_JUMPER6.2
  Bottom Layer w0.5: H_JUMPER6.2 10.93,24.83 CAN_EXP.2
L: length 27.6
  Top Layer w0.5: 79.6,30.7 CAN1.1 78,27.36 77.32,26.68 72.19,26.68 L_JUMPER1.2 ; 79.6,30.7 81.9,28.4 81.9,26.98 81.9,26.98 81.9,26.9 82.22,26.58 U5.6 ; 79.6,30.7 79.7,30.7 81,32 81,35.6 82.4,37 R19.2
LO: length 14.3
  Top Layer w0.5: CAN6.5 7,29.47 L_JUMPER6.1 5.13,27.6 R29.1
  Bottom Layer w0.5: CAN_EXP.1 5.53,25.77 L_JUMPER6.1
N1: length 89
  Top Layer w0.25: v1(74.4,15.5) 74.15,15.25 U6.42 ; U1.2 6.76,17.5 8.21,16.05 12.09,16.05 14.2,13.94 14.2,7 v1(15.1,6.1)
  Inner2 w0.25: v1(74.4,15.5) 74.17,15.73 72.28,15.73 v1(72.15,15.6)
  Bottom Layer w0.25: v1(15.1,6.1) 17.1,4.1 59.58,4.1 61,5.52 61,6.08 64.47,9.55 65.7,9.55 70.1,13.95 70.1,14.62 71.38,15.9 71.85,15.9 v1(72.15,15.6)
N2: length 84.7
  Top Layer w0.25: U6.43 74.65,14.85 v1(75.3,15.5) ; U2.2 10.42,17.5 10.98,16.94 10.98,16.58 11.16,16.4 12.24,16.4 14.8,13.84 v1(14.8,7.5)
  Inner2 w0.25: v1(75.3,15.5) 74.72,16.08 72.62,16.08 v1(72.3,16.4)
  Bottom Layer w0.25: v1(14.8,7.5) 15.8,6.5 60.92,6.5 64.32,9.9 65.55,9.9 69.75,14.1 69.75,14.76 71.39,16.4 v1(72.3,16.4)
NRST: length 24.5
  Top Layer w0.25: RESET.2' RESET.2 69.39,19.3 71.66,17.02 72.56,17.02 73.33,16.25 v1(77.4,16.25) U6.10
  Bottom Layer w0.25: NRST.1 80.35,13.3 v1(77.4,16.25)
RX: length 13.9
  Top Layer w0.25: v1(79.6,25.4) 79.6,25.7 79.82,25.92 80.49,25.92 ; U6.19 74.15,17.05 v1(74.3,16.9)
  Bottom Layer w0.25: v1(74.3,16.9) 74.3,20.1 v1(79.6,25.4)
SWCLK: length 27.4
  Top Layer w0.25: v1(73.5,15.1) 73.5,13.2 72.38,12.08 71.96,12.08 71.71,11.83 70.23,11.83 U6.36 69.19,11.75 BOOT.2 BOOT.2' 66.87,17.93 R13.1
  Bottom Layer w0.25: v1(73.5,15.1) 74.02,14.58 78.58,14.58 81.85,11.3 SWCLK.1
SWDIO: length 30.3
  Top Layer w0.25: U6.35 71.64,12.25 71.81,12.43 72.03,12.43 72.6,13 v1(72.6,14.9) ; v1(76.8,21.7) 76.8,22.6 77.88,23.68 R11.1
  Bottom Layer w0.25: v1(76.8,21.7) 74.88,19.78 74.88,16.66 74.28,16.06 73.43,16.06 72.6,15.24 v1(72.6,14.9) 73.28,14.22 78.43,14.22 83.36,9.3 SWDIO.1
TH1: length 52.2
  Top Layer w0.25: C4.2 32.03,22.86 R8.2 33.13,25.3 v1(37.83,25.3) ; U6.13 77.15,18.45 v1(77.85,18.45)
  Inner2 w0.25: v1(77.85,18.45) 77.85,19.55 77.23,20.17 77.23,20.34 76.89,20.68 76.72,20.68 72.1,25.3 v1(37.83,25.3)
TH2: length 43.7
  Top Layer w0.25: C9.2 37.83,22.86 R15.2 37.88,24.2 v1(38.4,24.72) ; U6.14 v1(76.65,20.1)
  Inner2 w0.25: v1(38.4,24.72) 72.03,24.72 v1(76.65,20.1)
TH3: length 37.6
  Top Layer w0.25: C11.2 43.63,22.86 R18.2 44.94,25.5 70.09,25.5 76.15,19.45 U6.15
TH4: length 31
  Top Layer w0.25: C13.2 49.43,22.86 R22.2 50.38,25.15 69.95,25.15 75.65,19.45 U6.16
TH5: length 24.4
  Top Layer w0.25: U6.17 75.15,19.45 69.8,24.8 55.83,24.8 R25.2 55.23,22.86 C14.2
TH6: length 17.9
  Top Layer w0.25: C15.2 61.03,22.86 R28.2 61.28,24.45 69.65,24.45 74.65,19.45 U6.18
TX: length 17.2
  Top Layer w0.25: v1(79.7,28.4) 79.7,28.1 79.93,27.88 U5.1 ; U6.20 73.65,17.05 v1(73.5,16.9)
  Bottom Layer w0.25: v1(73.5,16.9) 73.5,20.12 79.7,26.32 v1(79.7,28.4)
XIN: length 6.1
  Top Layer w0.25: U6.8 79.35,15.25 79.85,14.75 C5.2 80.68,14.75 81.33,15.4 82.95,15.4 83.6,14.75 X1.1
XOUT: length 3.7
  Top Layer w0.25: X1.3 81.66,16.25 C6.2 79.85,16.25 79.35,15.75 U6.9

## Copper pours and planes (outline as drawn; the poured copper is in the pictures)
+5V on Inner2: 67.8,8 86.41,8 86.41,-1.09 86.4,-1.1 67.8,-1.1
GND on Top Layer: -2.6,45.7 93.4,45.7 97.7,50 97.7,-1.9 93.2,-6.4 -11.6,-6.4 -13.2,-8 -13.2,35.1
GND on Bottom Layer: -8.5,45.2 77,45.2 83.9,52.1 89,52.1 91.1,50 91.1,-2.2 84.5,-8.8 -7.4,-8.8 -8,-9.4 -8.5,-8.9
GND on Inner2: -6.8,46.4 92.1,46.4 92.5,46.8 92.5,-1.4 97.2,-6.1 -1.6,-6.1 -3,-7.5 -6.8,-3.7
VIN on Top Layer: 12.2,10.3 12.2,-1.6 -0.3,-1.6 -0.6,-1.3 -0.6,10.3
VIN on Inner1: -7.3,48.4 92.4,48.4 92.8,48.8 95.4,46.2 95.4,-11.6 -10.6,-11.6 -10.9,-11.9 -10.9,44.8
$F1_2 on Top Layer: -0.6,16.5 12.2,16.5 12.2,10.3 -0.6,10.3 -0.6,16.5

## Text on the board
Bottom Silkscreen Layer: VIN | GND | H | L | PINOUT OF PINS ON THIS SIDE | Isik's Tech - XBST LLC | 5V | PB4 | PB3 | 3.3V | PA2 | PA9 | PA8 | PA3 | PC7 | PC6 | PA4 | PD0 | PA15 | PA5 | PD3 | PD2 | PA6 | PB7 | PB6 | PA7 | PB9 | PB8 | v1.0 | Birds' Nest CAN
